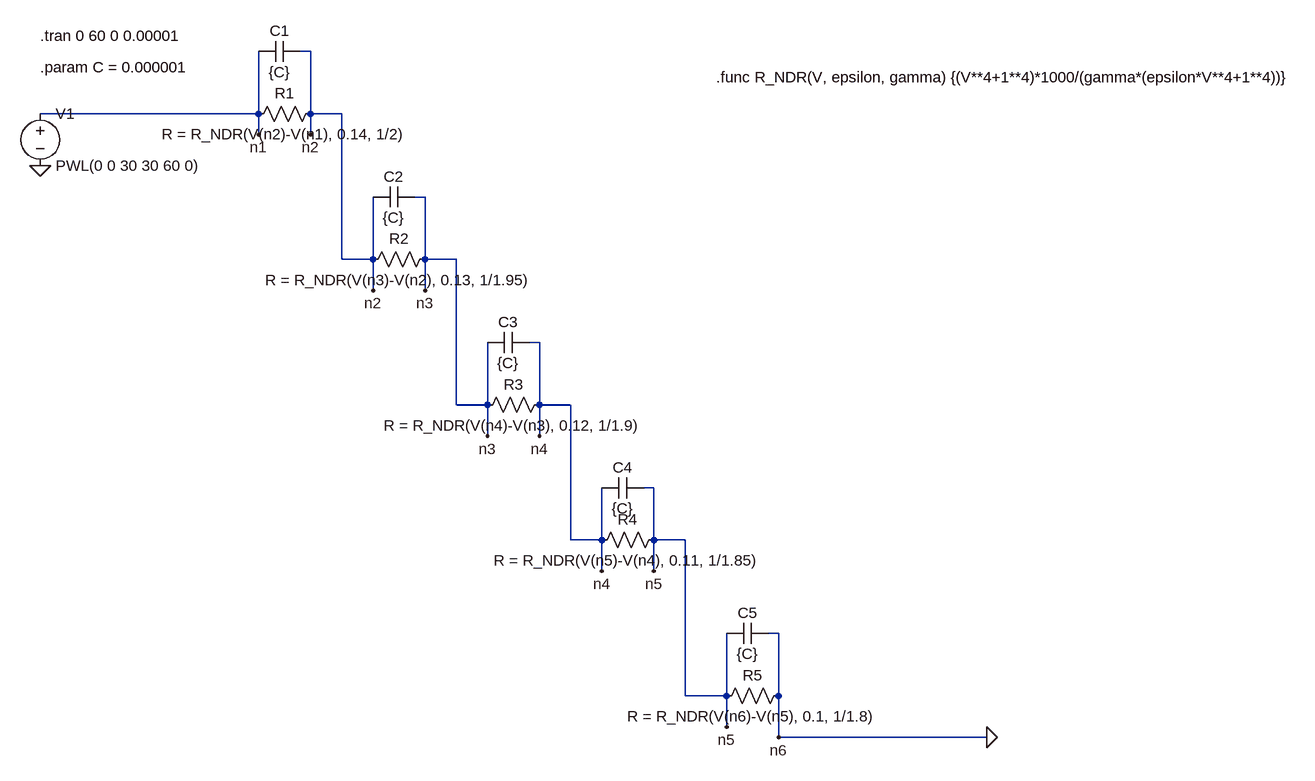
[diagram p0: schematic 5_ndr.asc]
5_ndr.asc, the LTspice schematic file:
Version 4
SHEET 1 6132 1244
WIRE 208 0 192 0
WIRE 128 96 128 0
WIRE 128 96 -208 96
WIRE 208 96 208 0
WIRE 256 96 208 96
WIRE 128 128 128 96
WIRE 208 128 208 96
WIRE 384 224 368 224
WIRE 256 320 256 96
WIRE 304 320 304 224
WIRE 304 320 256 320
WIRE 384 320 384 224
WIRE 432 320 384 320
WIRE 304 368 304 320
WIRE 384 368 384 320
WIRE 560 448 544 448
WIRE 432 544 432 320
WIRE 480 544 480 448
WIRE 480 544 432 544
WIRE 560 544 560 448
WIRE 608 544 560 544
WIRE 480 592 480 544
WIRE 560 592 560 544
WIRE 736 672 720 672
WIRE 608 752 608 544
WIRE 656 752 656 672
WIRE 656 752 608 752
WIRE 736 752 736 672
WIRE 784 752 736 752
WIRE 656 800 656 752
WIRE 736 800 736 752
WIRE 928 896 912 896
WIRE 784 992 784 752
WIRE 848 992 848 896
WIRE 848 992 784 992
WIRE 928 992 928 896
WIRE 848 1040 848 992
WIRE 928 1056 928 992
WIRE 1248 1056 928 1056
FLAG 128 128 n1
FLAG 208 128 n2
FLAG 480 592 n3
FLAG 560 592 n4
FLAG 656 800 n4
FLAG 736 800 n5
FLAG 848 1040 n5
FLAG 928 1056 n6
FLAG 1248 1056 0
FLAG -208 176 0
FLAG 304 368 n2
FLAG 384 368 n3
SYMBOL res 112 112 R270
WINDOW 0 32 56 VTop 2
WINDOW 3 0 56 VBottom 2
SYMATTR InstName R1
SYMATTR Value R = R_NDR(V(n2)-V(n1), 0.14, 1/2)
SYMBOL cap 128 16 R270
WINDOW 0 32 32 VTop 2
WINDOW 3 0 32 VBottom 2
SYMATTR InstName C1
SYMATTR Value {C}
SYMBOL res 288 336 R270
WINDOW 0 32 56 VTop 2
WINDOW 3 0 56 VBottom 2
SYMATTR InstName R2
SYMATTR Value R = R_NDR(V(n3)-V(n2), 0.13, 1/1.95)
SYMBOL cap 304 240 R270
WINDOW 0 32 32 VTop 2
WINDOW 3 0 32 VBottom 2
SYMATTR InstName C2
SYMATTR Value {C}
SYMBOL res 464 560 R270
WINDOW 0 32 56 VTop 2
WINDOW 3 0 56 VBottom 2
SYMATTR InstName R3
SYMATTR Value R = R_NDR(V(n4)-V(n3), 0.12, 1/1.9)
SYMBOL cap 480 464 R270
WINDOW 0 32 32 VTop 2
WINDOW 3 0 32 VBottom 2
SYMATTR InstName C3
SYMATTR Value {C}
SYMBOL res 640 768 R270
WINDOW 0 32 56 VTop 2
WINDOW 3 0 56 VBottom 2
SYMATTR InstName R4
SYMATTR Value R = R_NDR(V(n5)-V(n4), 0.11, 1/1.85)
SYMBOL cap 656 688 R270
WINDOW 0 32 32 VTop 2
WINDOW 3 0 32 VBottom 2
SYMATTR InstName C4
SYMATTR Value {C}
SYMBOL res 832 1008 R270
WINDOW 0 32 56 VTop 2
WINDOW 3 0 56 VBottom 2
SYMATTR InstName R5
SYMATTR Value R = R_NDR(V(n6)-V(n5), 0.1, 1/1.8)
SYMBOL cap 848 912 R270
WINDOW 0 32 32 VTop 2
WINDOW 3 0 32 VBottom 2
SYMATTR InstName C5
SYMATTR Value {C}
SYMBOL voltage -208 80 R0
WINDOW 123 0 0 Left 0
WINDOW 39 0 0 Left 0
SYMATTR InstName V1
SYMATTR Value PWL(0 0 30 30 60 0)
TEXT -208 -24 Left 2 !.tran 0 60 0 0.00001
TEXT -208 24 Left 2 !.param C = 0.000001
TEXT 832 40 Left 2 !.func R_NDR(V, epsilon, gamma) {(V**4+1**4)*1000/(gamma*(epsilon*V**4+1**4))}

The netlist it stands for:
* 5_ndr.asc
R1 n1 n2 R = R_NDR(V(n2)-V(n1), 0.14, 1/2)
C1 n1 n2 {C}
R2 n2 n3 R = R_NDR(V(n3)-V(n2), 0.13, 1/1.95)
C2 n2 n3 {C}
R3 n3 n4 R = R_NDR(V(n4)-V(n3), 0.12, 1/1.9)
C3 n3 n4 {C}
R4 n4 n5 R = R_NDR(V(n5)-V(n4), 0.11, 1/1.85)
C4 n4 n5 {C}
R5 n5 0 R = R_NDR(V(n6)-V(n5), 0.1, 1/1.8)
C5 n5 0 {C}
V1 n1 0 PWL(0 0 30 30 60 0)
.tran 0 60 0 0.00001
.param C = 0.000001
.func R_NDR(V, epsilon, gamma) {(V**4+1**4)*1000/(gamma*(epsilon*V**4+1**4))}
.backanno
.end